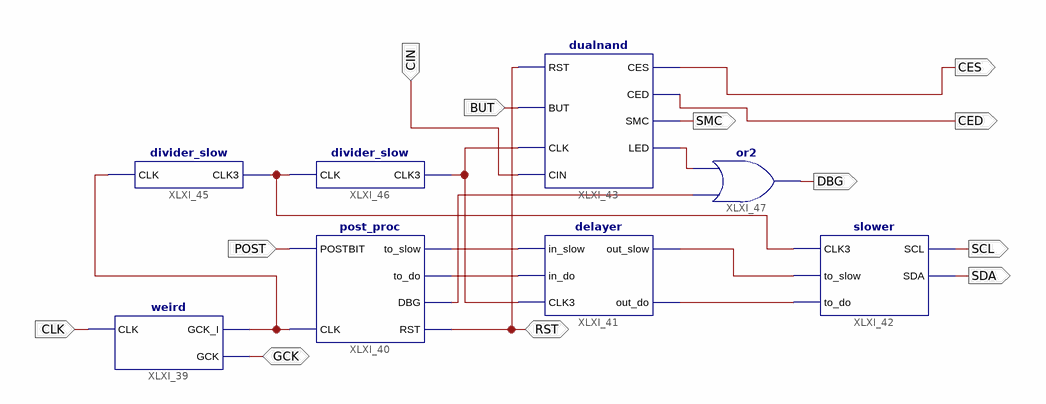
[diagram p0: schematic sheet 1]
// Xilinx ISE schematic overall.sch (xbr) as structural Verilog: 8 symbols, 12 ports
module overall (
  input  CLK,
  input  POST,
  input  BUT,
  input  CIN,
  inout  GCK,
  inout  RST,
  output CES,
  output CED,
  output SMC,
  output DBG,
  output SCL,
  output SDA
);

  wire XLXN_217, XLXN_218, XLXN_219, XLXN_220, XLXN_227, XLXN_228, XLXN_232, XLXN_233, XLXN_237;

  weird XLXI_39 (.CLK(CLK), .GCK_I(XLXN_232), .GCK(GCK));
  post_proc XLXI_40 (.POSTBIT(POST), .CLK(XLXN_232), .to_slow(XLXN_219), .to_do(XLXN_220), .DBG(XLXN_228), .RST(RST));
  delayer XLXI_41 (.in_slow(XLXN_219), .in_do(XLXN_220), .CLK3(XLXN_237), .out_slow(XLXN_217), .out_do(XLXN_218));
  slower XLXI_42 (.CLK3(XLXN_233), .to_slow(XLXN_217), .SCL(SCL), .SDA(SDA), .to_do(XLXN_218));
  dualnand XLXI_43 (.RST(RST), .BUT(BUT), .CLK(XLXN_237), .CES(CES), .CED(CED), .SMC(SMC), .LED(XLXN_227), .CIN(CIN));
  divider_slow XLXI_45 (.CLK(XLXN_232), .CLK3(XLXN_233));
  divider_slow XLXI_46 (.CLK(XLXN_233), .CLK3(XLXN_237));
  or XLXI_47 (DBG, XLXN_228, XLXN_227);
endmodule
